# Altium project Placa Principal.PrjPcb
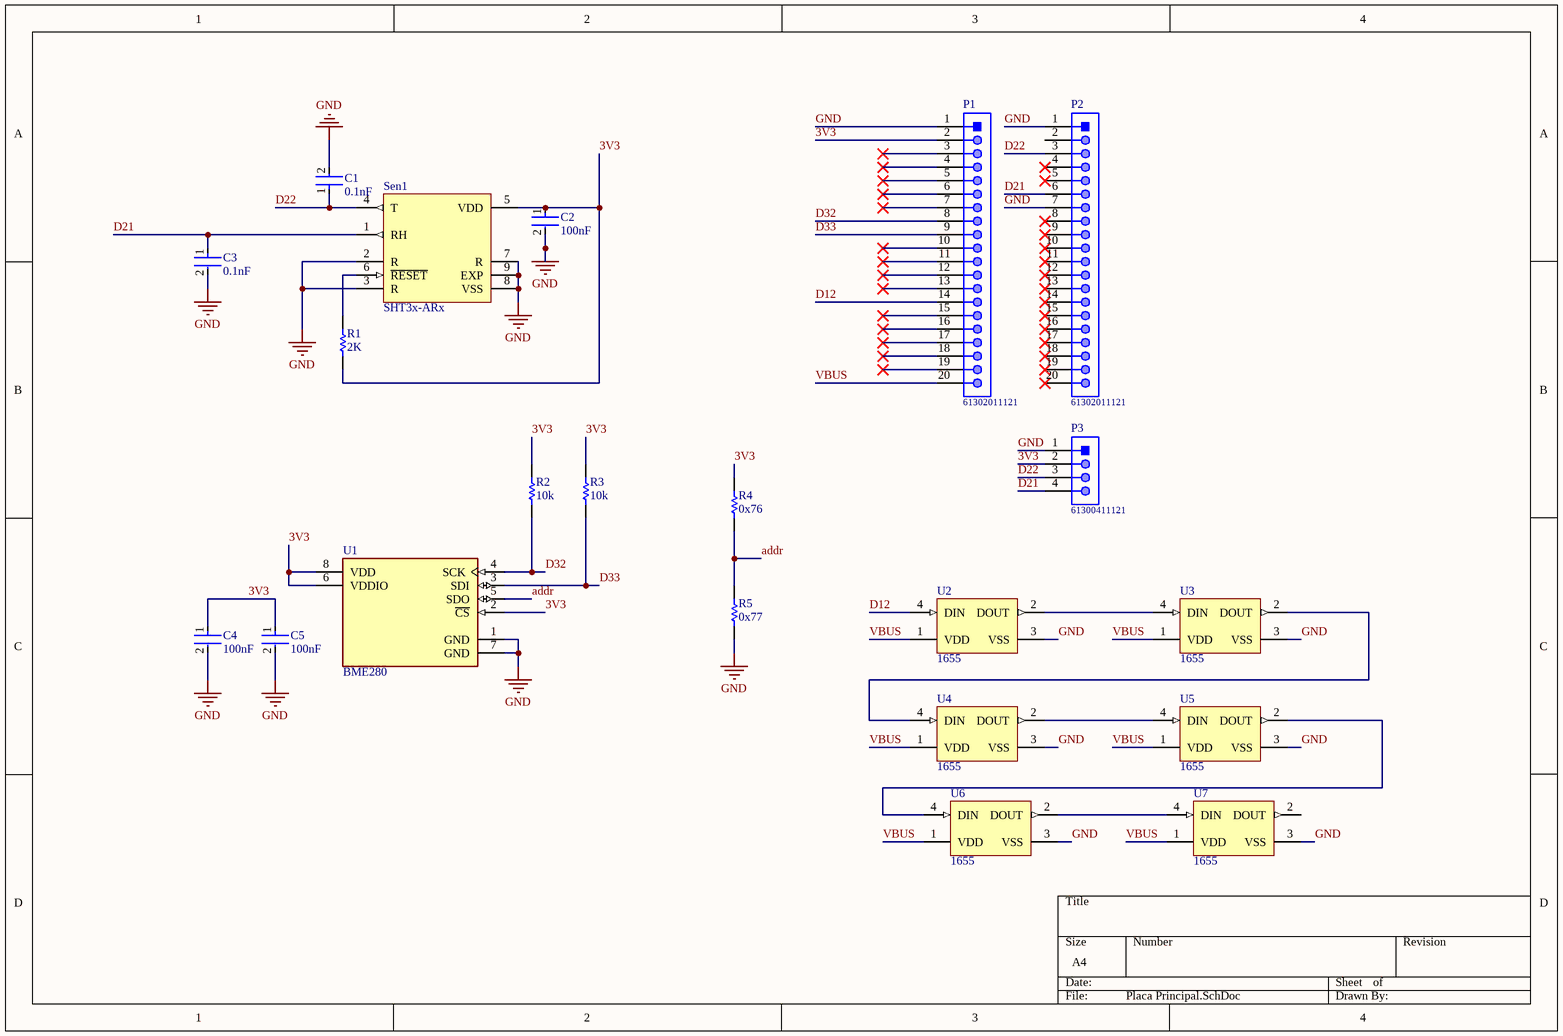
[diagram p0: Placa Principal.SchDoc]
1 sheet, 21 parts. Net scope: global (net labels, ports and power ports of the same name join across sheets).
Board file: Placa Principal.PcbDoc

## Sheet Placa Principal.SchDoc
size A4; SheetNumber: 1; SheetTotal: 1

### Parts
C1  0.1nF  [FP-C0805C-DN-MFG]
C2  100nF  [FP-C0805C-DN-MFG]
C3  0.1nF  [FP-C0805C-DN-MFG]
C4  100nF  [FP-C0805C-DN-MFG]
C5  100nF  [FP-C0805C-DN-MFG]
P1  61302011121  [61302011121]
P2  61302011121  [61302011121]
P3  61300411121  [61300411121]
R1  2K  [RESC2013X50X30ML20T20]
R2  10k  [RESC2013X60X35NL10T20]
R3  10k  [RESC2013X60X35NL10T20]
R4  0x76  [RESC2013X60X35NL10T20]
R5  0x77  [RESC2013X60X35NL10T20]
Sen1  SHT3x-ARx  [SHT3x]
U1  BME280  [FP-BME280-MFG]
U2  1655  [ADA-RGB-1655_V]
U3  1655  [ADA-RGB-1655_V]
U4  1655  [ADA-RGB-1655_V]
U5  1655  [ADA-RGB-1655_V]
U6  1655  [ADA-RGB-1655_V]
U7  1655  [ADA-RGB-1655_V]

### Nets
GND: C1.2 C2.2 C3.2 C4.2 C5.2 P1.1 P2.1 P2.7 P3.1 R5.1 Sen1.2(R) Sen1.3(R) Sen1.7(R) Sen1.8(VSS) Sen1.9(EXP) U1.1(GND) U1.7(GND) U2.3(VSS) U3.3(VSS) U4.3(VSS) U5.3(VSS) U6.3(VSS) U7.3(VSS)
3V3: C2.1 C4.1 C5.1 P1.2 P3.2 R1.1 R2.2 R3.2 R4.2 Sen1.5(VDD) U1.2(~{CS}) U1.6(VDDIO) U1.8(VDD)
addr: R4.1 R5.2 U1.5(SDO)
D12: P1.14 U2.4(DIN)
D21: C3.1 P2.6 P3.4 Sen1.1(RH)
D22: C1.1 P2.3 P3.3 Sen1.4(T)
D32: P1.8 R2.1 U1.4(SCK)
D33: P1.9 R3.1 U1.3(SDI)
VBUS: P1.20 U2.1(VDD) U3.1(VDD) U4.1(VDD) U5.1(VDD) U6.1(VDD) U7.1(VDD)
NetR1_2: R1.2 Sen1.6(~{RESET})
NetU2_2: U2.2(DOUT) U3.4(DIN)
NetU3_2: U3.2(DOUT) U4.4(DIN)
NetU4_2: U4.2(DOUT) U5.4(DIN)
NetU5_2: U5.2(DOUT) U6.4(DIN)
NetU6_2: U6.2(DOUT) U7.4(DIN)

Not connected (* = marked no-connect by the designer): P1 3* 4* 5* 6* 7* 10* 11* 12* 13* 15* 16* 17* 18* 19*; P2 2 4* 5* 8* 9* 10* 11* 12* 13* 14* 15* 16* 17* 18* 19* 20*; U7 2(DOUT)

### Library data of the parts
C1-C5 = CMP-2007-00279-2: CAP CER 0.1UF 50V X7R 0805; Manufacturer Part Number: C0805C104K5RACTU; Manufacturer: KEMET; Value: 0.10 μF; Tolerance: 0.1; Temperature Coefficient: 30ppm/°C; Material: Ceramic; Device Class L2: Capacitors; Temperature Range Low: -55°C; Voltage Rating: 50 V; Digikey Description: CAP CER 0.1UF 50V X7R 0805; Category: Cap; ComponentLink2Description: Datasheet; Octopart: https://octopart.com/c0805c104k5ractu-kemet-143926; RoHS: TRUE; ComponentLink2URL: https://content.kemet.com/datasheets/KEM_C1003_C0G_SMD.pdf; Temperature Characteristic: X7R; Temperature: -55°C to +125°C; Height: 0.88mm; Temperature Range High: +125°C; Device Class L1: Passive Components; Automotive: No; Lead Free: Yes; Ipc Land Pattern Name: CAPC200125X78; Device Class L3: Ceramic Capacitors; Mouser Description: Cap Ceramic 0.1uF 50V X7R 10% SMD 2.0 x 1.2 mm 125 C Paper T/R; Capacitance: 0.10 μF; Package: C0805C-DN
P1 P2 = CMP-1502-01102-1: THT Vertical Pin Header WR-PHD, Pitch 2.54 mm, Single Row, 20 pins; Manufacturer: Wurth Elektronik; Withstanding Voltage: 500VAC; Gender: Male; Pin Number: 20; Rated Current: 3A; Contact Resistance: 20mOhm; Pitch: 2.54mm; Working Voltage: 250VAC; Publisher: WurthElektronik; Packaging: Bag; Datasheet URL: https://katalog.we-online.de/em/datasheet/6130xx11121.pdf; Row Number: Single; Mounting Technology: THT; Manufacturer URL: http://www.we-online.de; Orientation: Vertical; Package Reference: 61302011121; Part Number: 61302011121; Operating Temperature: -40to105degC
P3 = CMP-1502-01064-1: THT Vertical Pin Header WR-PHD, Pitch 2.54 mm, Single Row, 4 pins; Manufacturer: Wurth Elektronik; Withstanding Voltage: 500VAC; Rated Current: 3A; Working Voltage: 250VAC; Pin Number: 4; Gender: Male; Contact Resistance: 20mOhm; Pitch: 2.54mm; Manufacturer URL: http://www.we-online.de; Operating Temperature: -40to105degC; Packaging: Bag; Mounting Technology: THT; Package Reference: 61300411121; Datasheet URL: https://katalog.we-online.de/em/datasheet/6130xx11121.pdf; Publisher: WurthElektronik; Part Number: 61300411121; Row Number: Single; Orientation: Vertical
R1 = CMP-2001-04896-1: Manufacturer: Vishay Dale; Part Number: CRCW08050000Z0EA
R2-R5 = CMP-1659-00013-4: Chip Resistor, 10 KOhm, +/- 1%, 0.125 W, -55 to 155 degC, 0805 (2012 Metric), RoHS, Tape and Reel; Manufacturer: Yageo; Voltage Rating: 150 V; Mount: Surface Mount; ComponentLink1Description: Manufacturer URL; ComponentLink2URL: http://www.yageo.com/documents/recent/PYu-RC_Group_51_RoHS_L_04.pdf; Pins: 2; Length: 2 mm; Min Operating Temperature: -55 degC; Height: 0.5 mm; Mounting Technology: Surface Mount; RoHSCompliant: true; REACH SVHC: No SVHC; ComponentLink1URL: http://www.yageo.com/; Max Operating Temperature: 155 degC; PackageReference: 0805; DatasheetVersion: Rev. 4, 02/2016; Package Quantity: 5000; Packaging: Tape and Reel; ComponentLink2Description: Datasheet; PackageDescription: 2-Pin Surface Mounted Device, Body 2 x 1.25 mm
U1 = CMP-2000-05073-3: SENSOR PRESSURE HUMIDITY TEMP; Sensor Type: Temperature; Accuracy: 3%; Response Time: 1s; Output Type: SPI; Min Operating Temperature: -40°C; Max Operating Temperature: 85°C; Case/Package: LGA; Packaging: Cut Tape; Mount: Surface Mount; Lead Free: Lead Free; Number of Pins: 8
U2-U7 = CMP-2000-05026-1: Intelligent Control LED Integrated Light Source, 3.5 to 5.3 V, -25 to 80 degC, 4-Pin SMD, RoHS, Tape and Reel; Manufacturer: Adafruit-Industries-LLC; Number of LEDs: 10; Configuration: Discrete; Utilized LED: WS2812(5050); Datasheet URL: http://datasheet.octopart.com/ADA1655-Adafruit-Industries-datasheet-32028139.pdf; Series: Neopixel; Interface: -; Package Description: 4-Pin Surface Mount Device, Body 5 x 5 mm; Color: Red,Green,Blue(RGB); Category: Optoelectronics; Controller Type: -; Package Reference: 1655; Manufacturer URL: https://www.adafruit.com/; Mounting Type: SurfaceMount; Datasheet Version: May-13; Size / Dimension: 5.00mmLx5.00mmW; Family: Addressable,Specialty